# Altium schematic sheet STM32_POWER.SchDoc
size A4; SheetNumber: 2; SheetTotal: 14
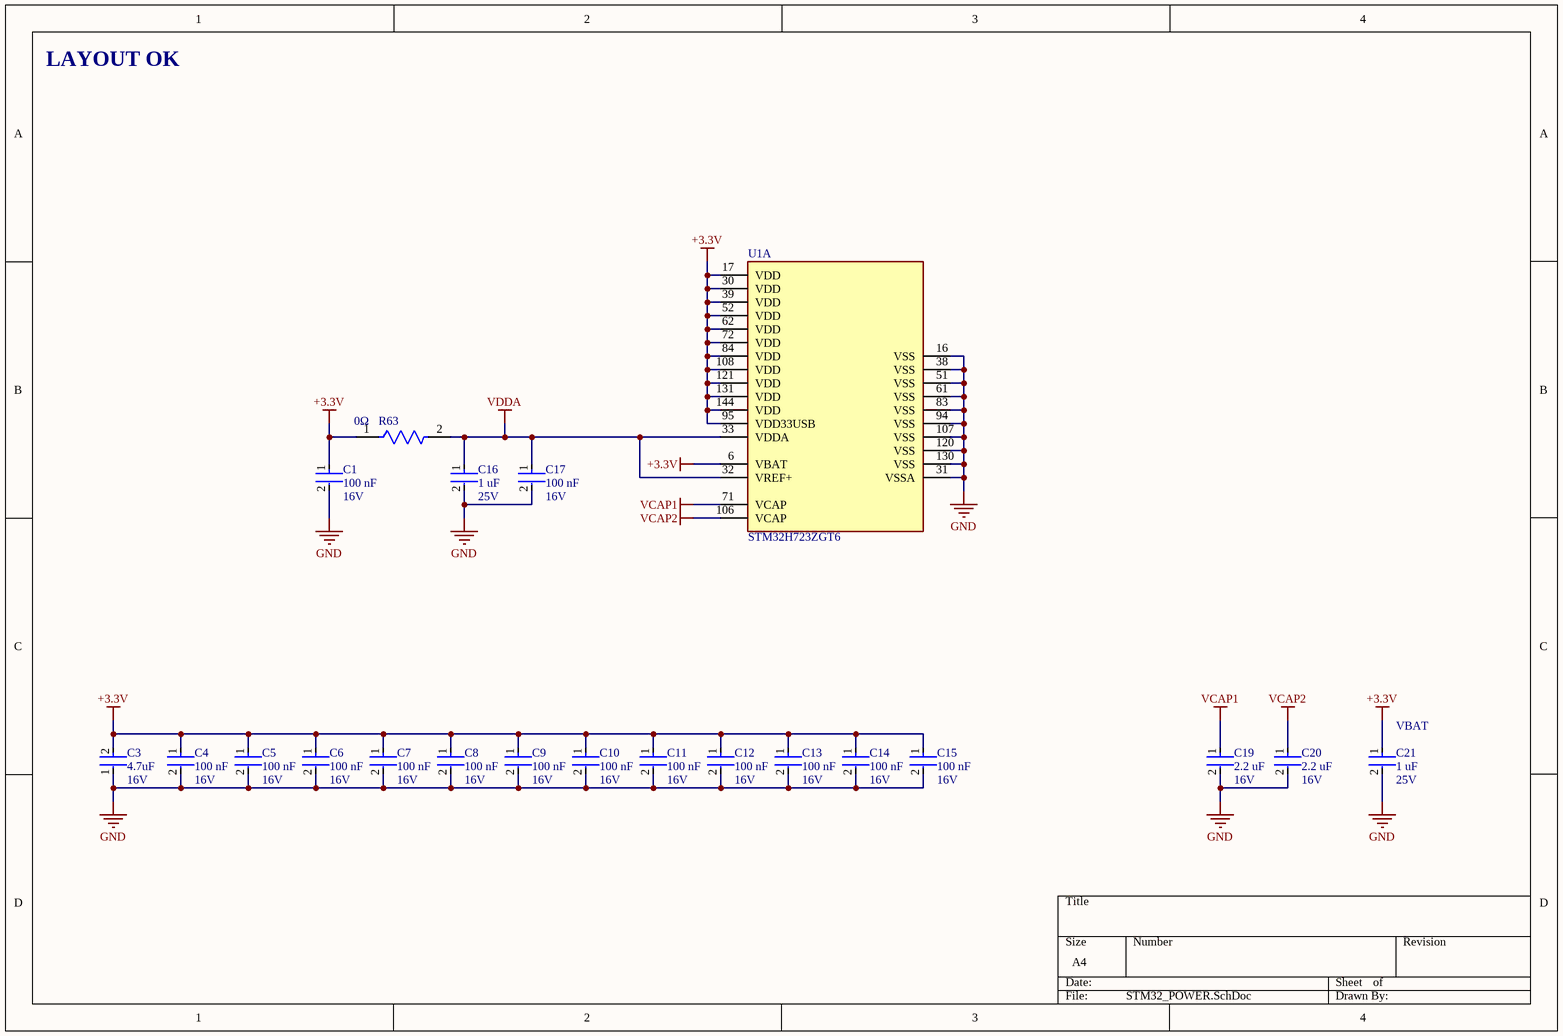
[diagram p0: STM32_POWER.SchDoc]

## Parts
C1  Capacitance: 100 nF  Voltage Rating: 16V  [FP-CL752-IPC_B]  (hidden comment: CL05B104KO5VPNC)
C3  Voltage: 16V  Capacitance: 4.7uF  [FP-C1608-080-0_1-IPC_B]  (hidden comment: C1608X5R1C475K080AC)
C4  Capacitance: 100 nF  Voltage Rating: 16V  [FP-CL752-IPC_B]  (hidden comment: CL05B104KO5VPNC)
C5  Capacitance: 100 nF  Voltage Rating: 16V  [FP-CL752-IPC_B]  (hidden comment: CL05B104KO5VPNC)
C6  Capacitance: 100 nF  Voltage Rating: 16V  [FP-CL752-IPC_B]  (hidden comment: CL05B104KO5VPNC)
C7  Capacitance: 100 nF  Voltage Rating: 16V  [FP-CL752-IPC_B]  (hidden comment: CL05B104KO5VPNC)
C8  Capacitance: 100 nF  Voltage Rating: 16V  [FP-CL752-IPC_B]  (hidden comment: CL05B104KO5VPNC)
C9  Capacitance: 100 nF  Voltage Rating: 16V  [FP-CL752-IPC_B]  (hidden comment: CL05B104KO5VPNC)
C10  Capacitance: 100 nF  Voltage Rating: 16V  [FP-CL752-IPC_B]  (hidden comment: CL05B104KO5VPNC)
C11  Capacitance: 100 nF  Voltage Rating: 16V  [FP-CL752-IPC_B]  (hidden comment: CL05B104KO5VPNC)
C12  Capacitance: 100 nF  Voltage Rating: 16V  [FP-CL752-IPC_B]  (hidden comment: CL05B104KO5VPNC)
C13  Capacitance: 100 nF  Voltage Rating: 16V  [FP-CL752-IPC_B]  (hidden comment: CL05B104KO5VPNC)
C14  Capacitance: 100 nF  Voltage Rating: 16V  [FP-CL752-IPC_B]  (hidden comment: CL05B104KO5VPNC)
C15  Capacitance: 100 nF  Voltage Rating: 16V  [FP-CL752-IPC_B]  (hidden comment: CL05B104KO5VPNC)
C16  Capacitance: 1 uF  Voltage Rating: 25V  [FP-GCM188-0_1-IPC_B]  (hidden comment: GCM188R71E105KA64D)
C17  Capacitance: 100 nF  Voltage Rating: 16V  [FP-CL752-IPC_B]  (hidden comment: CL05B104KO5VPNC)
C19  Capacitance: 2.2 uF  Voltage Rating: 16V  [FP-CL10-IPC_B]  (hidden comment: CL10A225KO8NNNC)
C20  Capacitance: 2.2 uF  Voltage Rating: 16V  [FP-CL10-IPC_B]  (hidden comment: CL10A225KO8NNNC)
C21  Capacitance: 1 uF  Voltage Rating: 25V  [FP-GCM188-0_1-IPC_B]  (hidden comment: GCM188R71E105KA64D)
R63  Resistance: 0Ω  [FP-CRCW0603-HPe3-IPC_B]  (hidden comment: CRCW06030000Z0EAHP)
U1  STM32H723ZGT6  [CQFP50P2200X2200X160-144M]  (part A of 3)

## Nets
+3.3V: C1.1 C3.2 C4.1 C5.1 C6.1 C7.1 C8.1 C9.1 C10.1 C11.1 C12.1 C13.1 C14.1 C15.1 C21.1 R63.1 U1.6(VBAT) U1.17(VDD) U1.30(VDD) U1.39(VDD) U1.52(VDD) U1.62(VDD) U1.72(VDD) U1.84(VDD) U1.95(VDD33USB) U1.108(VDD) U1.121(VDD) U1.131(VDD) U1.144(VDD)
GND: C1.2 C3.1 C4.2 C5.2 C6.2 C7.2 C8.2 C9.2 C10.2 C11.2 C12.2 C13.2 C14.2 C15.2 C16.2 C17.2 C19.2 C20.2 C21.2 U1.16(VSS) U1.31(VSSA) U1.38(VSS) U1.51(VSS) U1.61(VSS) U1.83(VSS) U1.94(VSS) U1.107(VSS) U1.120(VSS) U1.130(VSS)
VCAP1: C19.1 U1.71(VCAP)
VCAP2: C20.1 U1.106(VCAP)
VDDA: C16.1 C17.1 R63.2 U1.32(VREF+) U1.33(VDDA)

## Notes on the sheet
- LAYOUT OK
- (near C21) VBAT

## Library data of the parts
C1 C4-C15 C17 = CMP-13271-002128-1: Cap Ceramic 100nF 16V X7R ±10% SMD 0402 +125°C Paper T/R; Length: 0.039inch; Case Code (Metric): 1005; Thickness: 0.022inch; Max Operating Temperature: 125°C; Mount: Surface Mount; Features: Soft Termination; Width: 0.02inch; Min Operating Temperature: -55°C; Tolerance: 10%; Case/Package: 0402; Packaging: Cut Tape; Ratings: AEC-Q200; Case Code (Imperial): 0402; Lead Free: Lead Free
C3 = CMP-2000-04981-2: Multilayer Ceramic Capacitors 4.7μF ±10% 16V X5R SMD 0603; Tolerance: 10%; Thickness: 0.035inch; Length: 1.6mm; Width: 0.031inch; Height: 0.8mm; Package Quantity: 1; Construction: Flat; Weight: 7.1E-05oz; Depth: 0.8mm; Case Code (Metric): 1608; Series: C; Lead Free: Lead Free; Voltage Rating: 16V; Voltage Rating (DC): 16V; Termination: SMD/SMT; Dielectric: X5R; REACH SVHC: No SVHC; RoHS Compliant: Yes; Case Code (Imperial): 0603; Case/Package: 0603; Mount: Surface Mount; Dielectric Material: Ceramic; Packaging: Tape and Reel; Min Operating Temperature: -55°C; Max Operating Temperature: 85°C
C16 C21 = CMP-2006-02363-4: Manufacturer Lifecycle Status: IN PRODUCTION; NexarPartId: 18909256; Dielectric: X7R; Material: Ceramic; Tolerance: 10%; Thickness: 889µm; Max Operating Temperature: 125°C; Radiation Hardening: No; Weight: 6.293594mg; Lead Free: Lead Free; Mount: Surface Mount; Case Code (Imperial): 0603; REACH SVHC: No SVHC; Lifecycle Status: Production; Depth: 800µm; Min Operating Temperature: -55°C; Height: 800µm; Case Code (Metric): 1608; Case/Package: 0603; Voltage: 25V; Packaging: Cut Tape; Length: 1.6mm; Termination: SMD/SMT; Width: 787.4µm; Voltage Rating (DC): 25V; RoHS: Compliant; Schedule B: 8532240020, 8532240020; Ratings: AEC-Q200
C19 C20 = CMP-13271-000835-1: Cap Ceramic 2.2uF 16V X5R ±10% Pad SMD 0603 +85°C T/R; Case Code (Metric): 1608; Height: 0.8mm; Case/Package: 0603; Depth: 0.8mm; Case Code (Imperial): 0603; Length: 1.6mm; Packaging: Tape and Reel; Material: Ceramic; Lead Free: Lead Free; Max Operating Temperature: 85°C; Contact Plating: Tin; Thickness: 0.035inch; Radiation Hardening: No; Tolerance: 10%; Min Operating Temperature: -55°C; Voltage: 16V; Dielectric: X5R; Mount: Surface Mount; Package Quantity: 4000; Width: 0.031inch; Voltage Rating (DC): 16V
R63 = CMP-2000-03817-2: RES Thick Film, 0Ω, , 0.33W, , 0603; Max Power Dissipation: 250mW; Voltage Rating (DC): 75V; Temperature Coefficient: 0ppm/°C; Mount: Surface Mount; Package Quantity: 5000; Features: Automotive AEC-Q200; Length: 1.6mm; Width: 0.033inch; Min Operating Temperature: -55°C; Max Operating Temperature: 155°C; Contact Plating: Tin; Depth: 0.85mm; Case/Package: 0603; Radiation Hardening: No; Military Standard: Not; Power Rating: 250mW; Height: 0.45mm; Composition: Thick Film; Lead Free: Lead Free; Voltage Rating: 75V; Case Code (Imperial): 0603; Weight: 7.1E-05oz; Number of Terminations: 2; Packaging: Tape and Reel; Number of Pins: 2; Case Code (Metric): 1608; Termination: SMD/SMT
U1 = STM32H723ZGT6: RISC Microcontroller, 32-Bit, FLASH, CORTEX-M7 CPU, 550MHz, CMOS, PQFP144; Manufacturer: STMicroelectronics; Interface: 39,40,224,1514,1515,1518,1532,1533Interface; Memory Format: 4498,11064MemoryType; Data Bus Width: 32b; Density: 1MB; Max Supply Voltage: 3.6V; Min Supply Voltage: 1.62V; Nominal Supply Current: 4uA; Number of A/D Converters: 1NUMBER; Number of ADC Channels: 16NUMBER; Number of I2C Channels: 5NUMBER; Number of I/Os: 112NUMBER; Number of SPI Channels: 6NUMBER; Number of Timers/Counters: 4NUMBER; RAM Size: 564KB; Supplier: Arrow Electronics; Supplier Part Number: STM32H723ZGT6; Manufacturer Part Number: STM32H723ZGT6; RoHS: No; Category: Microcontrollers; Stock: 2596; Pricing: 1=9.275, 10=9.182, 25=9.09, 50=8.999, 120=8.909, 300=8.175, 540=8.094 (USD); Min Operating Temperature: -40°C; Max Operating Temperature: 85°C; Frequency: 550MHz; Memory Size: 1MB; Number of Ethernet Channels: 1NUMBER; Number of UART Channels: 6NUMBER; Number of USB Channels: 1NUMBER; Height: 1.6mm